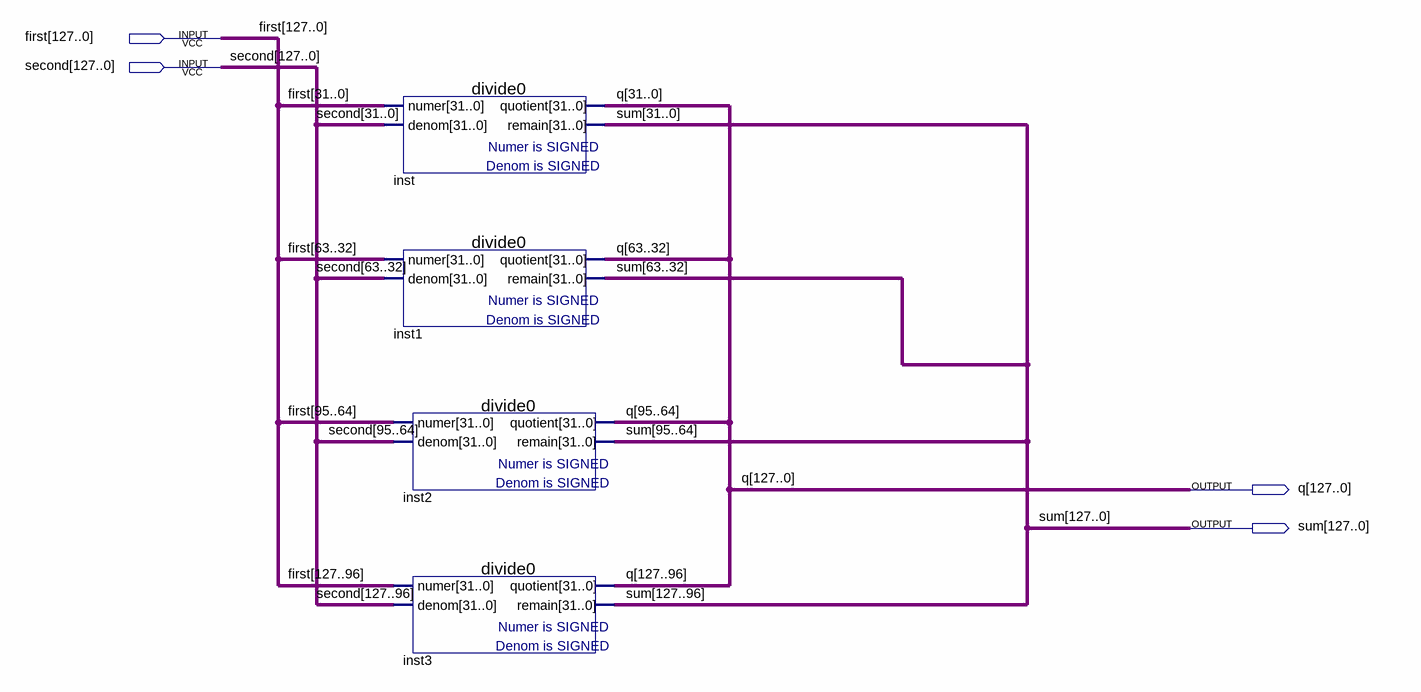
[diagram p0: schematic sheet]
// Quartus schematic DevidorPolynomial.bdf as structural Verilog: 4 symbols, 4 pins
module DevidorPolynomial (
  input  [127:0] first,
  input  [127:0] second,
  output [127:0] q,
  output [127:0] sum
);

  divide0 inst (.numer(first[31:0]), .denom(second[31:0]), .quotient(q[31:0]), .remain(sum[31:0]));
  divide0 inst1 (.numer(first[63:32]), .denom(second[63:32]), .quotient(q[63:32]), .remain(sum[63:32]));
  divide0 inst2 (.numer(first[95:64]), .denom(second[95:64]), .quotient(q[95:64]), .remain(sum[95:64]));
  divide0 inst3 (.numer(first[127:96]), .denom(second[127:96]), .quotient(q[127:96]), .remain(sum[127:96]));
endmodule
